# EAGLE design MaTouch ESP32-S3 2.13“ Quad-Color Eink V1.1 (EAGLE 6.1)
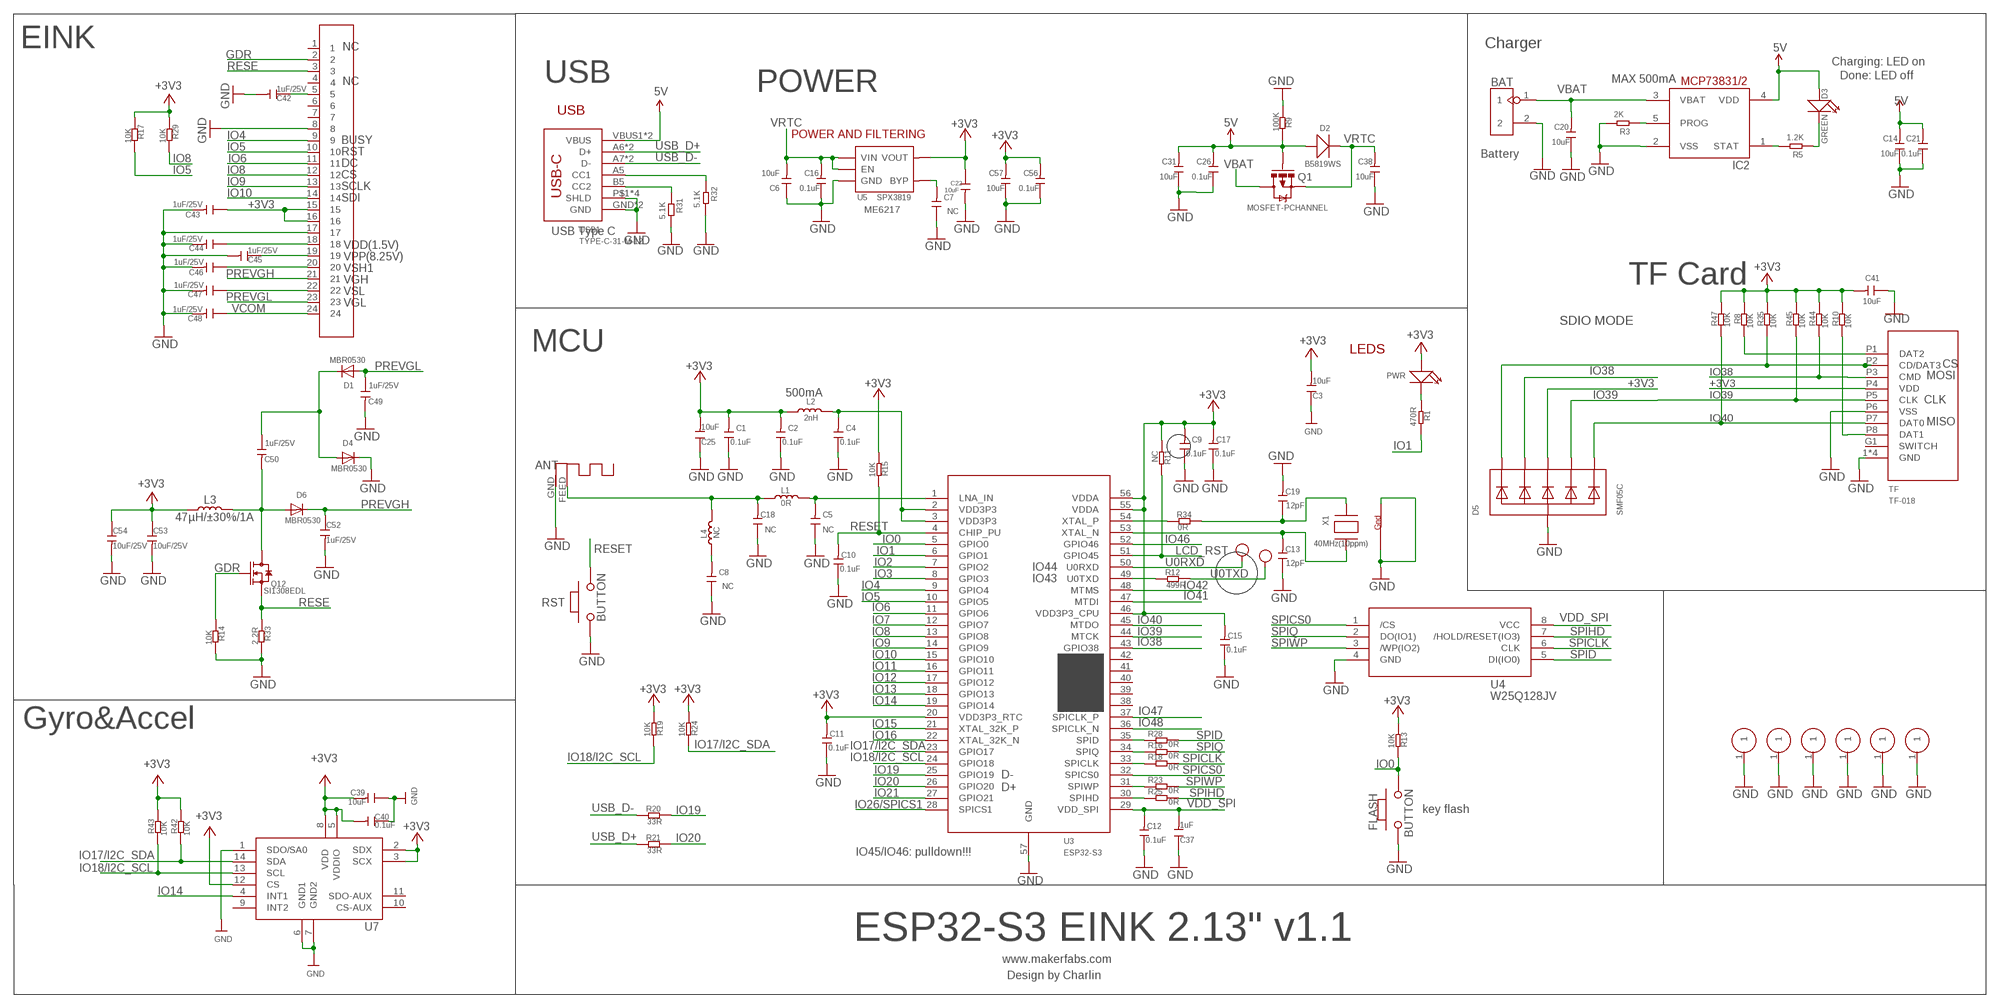
[diagram p0: schematic, sheet 1]

## Parts
ANT1  ANTENNA  [RN-ANT]
BAT  HEADER-2P-2.0  [2P-2.0]
C1  0.1uF  DISCRETE_C-0402  [DISCRETE_C0402]
C2  0.1uF  DISCRETE_C-0402  [DISCRETE_C0402]
C3  10uF  DISCRETE_C-0603  [DISCRETE_C0603]
C4  0.1uF  DISCRETE_C-0402  [DISCRETE_C0402]
C5  NC  DISCRETE_C-0402  [DISCRETE_C0402]
C6  10uF  DISCRETE_C-0603  [DISCRETE_C0603]
C7  NC  DISCRETE_C-0402  [DISCRETE_C0402]
C8  NC  DISCRETE_C-0402  [DISCRETE_C0402]
C9  0.1uF  DISCRETE_C-0402  [DISCRETE_C0402]
C10  0.1uF  DISCRETE_C-0402  [DISCRETE_C0402]
C11  0.1uF  DISCRETE_C-0402  [DISCRETE_C0402]
C12  0.1uF  DISCRETE_C-0402  [DISCRETE_C0402]
C13  12pF  DISCRETE_C-0402  [DISCRETE_C0402]
C14  10uF  DISCRETE_C-0402  [DISCRETE_C0402]
C15  0.1uF  DISCRETE_C-0402  [DISCRETE_C0402]
C16  0.1uF  DISCRETE_C-0402  [DISCRETE_C0402]
C17  0.1uF  DISCRETE_C-0402  [DISCRETE_C0402]
C18  NC  DISCRETE_C-0402  [DISCRETE_C0402]
C19  12pF  DISCRETE_C-0402  [DISCRETE_C0402]
C20  10uF  DISCRETE_C-0402  [DISCRETE_C0402]
C21  0.1uF  DISCRETE_C-0402  [DISCRETE_C0402]
C22  10uF  C-0603  [0603]
C25  10uF  DISCRETE_C-0603  [DISCRETE_C0603]
C26  0.1uF  DISCRETE_C-0402  [DISCRETE_C0402]
C31  10uF  DISCRETE_C-0402  [DISCRETE_C0402]
C37  1uF  DISCRETE_C-0603  [DISCRETE_C0603]
C38  10uF  DISCRETE_C-0402  [DISCRETE_C0402]
C39  10uF  DISCRETE_C-0402  [DISCRETE_C0402]
C40  0.1uF  DISCRETE_C-0402  [DISCRETE_C0402]
C41  10uF  DISCRETE_C-0402  [DISCRETE_C0402]
C42  1uF/25V  DISCRETE_C-0402  [DISCRETE_C0402]
C43  1uF/25V  DISCRETE_C-0402  [DISCRETE_C0402]
C44  1uF/25V  DISCRETE_C-0402  [DISCRETE_C0402]
C45  1uF/25V  DISCRETE_C-0402  [DISCRETE_C0402]
C46  1uF/25V  DISCRETE_C-0402  [DISCRETE_C0402]
C47  1uF/25V  DISCRETE_C-0402  [DISCRETE_C0402]
C48  1uF/25V  DISCRETE_C-0402  [DISCRETE_C0402]
C49  1uF/25V  DISCRETE_C-0402  [DISCRETE_C0402]
C50  1uF/25V  DISCRETE_C-0402  [DISCRETE_C0402]
C52  1uF/25V  C-0603  [0603]
C53  10uF/25V  C-0603  [0603]
C54  10uF/25V  C-0603  [0603]
C56  0.1uF  DISCRETE_C-0402  [DISCRETE_C0402]
C57  10uF  DISCRETE_C-0402  [DISCRETE_C0402]
D1  MBR0530  DIODESOD-323F  [SOD-323F]
D2  B5819WS  D'0805'  [SOD323]
D3  GREEN  DISCRETE_LED0603  [DISCRETE_LED-0603]
D4  MBR0530  DIODESOD-323F  [SOD-323F]
D5  SMF05C  TVSARRAY_5LANE  [SOT363]
D6  MBR0530  DIODESOD-323F  [SOD-323F]
FLASH  BUTTON  PB157  [157SW]
IC2  TP4054  MCP73831/OT  [SOT23-5L]
J1  FPC24-80P-A  [SMD24-80P-1960L440W]
L1  0R  DISCRETE_L0402  [DISCRETE_L0402]
L2  2nH  DISCRETE_L0603  [DISCRETE_L0603]
L3  47µH/±30%/1A  INDUCTOR-CR54-47UH  [CR54]
L4  NC  DISCRETE_L0402  [DISCRETE_L0402]
PWR  DISCRETE_LED0603  [DISCRETE_LED-0603]
Q1  MOSFET-PCHANNEL  [SOT23-3]
Q12  SI1308EDL  MOSFET-N'SOT23'  [SOT23]
R1  470R  DISCRETE_R-0402  [DISCRETE_R0402]
R3  2K  DISCRETE_R-0402  [DISCRETE_R0402]
R5  1.2K  DISCRETE_R-0402  [DISCRETE_R0402]
R8  10K  DISCRETE_R-0402  [DISCRETE_R0402]
R9  100K  DISCRETE_R-0402  [DISCRETE_R0402]
R10  10K  DISCRETE_R-0402  [DISCRETE_R0402]
R11  NC  DISCRETE_R-0402  [DISCRETE_R0402]
R12  499R  DISCRETE_R-0402  [DISCRETE_R0402]
R13  10K  DISCRETE_R-0402  [DISCRETE_R0402]
R14  10K  DISCRETE_R-0402  [DISCRETE_R0402]
R15  10K  DISCRETE_R-0402  [DISCRETE_R0402]
R16  0R  DISCRETE_R-0402  [DISCRETE_R0402]
R17  10K  DISCRETE_R-0402  [DISCRETE_R0402]
R18  0R  DISCRETE_R-0402  [DISCRETE_R0402]
R19  10K  DISCRETE_R-0402  [DISCRETE_R0402]
R20  33R  DISCRETE_R-0402  [DISCRETE_R0402]
R21  33R  DISCRETE_R-0402  [DISCRETE_R0402]
R23  0R  DISCRETE_R-0402  [DISCRETE_R0402]
R24  10K  DISCRETE_R-0402  [DISCRETE_R0402]
R25  0R  DISCRETE_R-0402  [DISCRETE_R0402]
R28  0R  DISCRETE_R-0402  [DISCRETE_R0402]
R29  10K  DISCRETE_R-0402  [DISCRETE_R0402]
R31  5.1K  DISCRETE_R-0402  [DISCRETE_R0402]
R32  5.1K  DISCRETE_R-0402  [DISCRETE_R0402]
R33  2.2R  DISCRETE_R-0402  [DISCRETE_R0402]
R34  0R  DISCRETE_R-0402  [DISCRETE_R0402]
R35  10K  DISCRETE_R-0402  [DISCRETE_R0402]
R42  10K  DISCRETE_R-0402  [DISCRETE_R0402]
R43  10K  DISCRETE_R-0402  [DISCRETE_R0402]
R44  10K  DISCRETE_R-0402  [DISCRETE_R0402]
R45  10K  DISCRETE_R-0402  [DISCRETE_R0402]
R47  10K  DISCRETE_R-0402  [DISCRETE_R0402]
RST  BUTTON  PB157  [157SW]
RX  TEST-POINT'4545'  [TP-D45MIL]
S1  ONEPIN01  [ONEPIN01]
S2  ONEPIN01  [ONEPIN01]
S3  ONEPIN01  [ONEPIN01]
S4  ONEPIN01  [ONEPIN01]
S5  ONEPIN01  [ONEPIN01]
S6  ONEPIN01  [ONEPIN01]
TF  TF-018  [TF-018]
TX  TEST-POINT'4545'  [TP-D45MIL]
U3  ESP32-S3  [QFN56-7*7MM]
U4  W25Q128JV  [SOIC-8-208MIL]
U5  SPX3819  [SOT23-5]
U7  QMI8658A  [LGA14-50P-300L250W86H]
USB1  TYPE-C-31-M-12  [TYPE-C-31-M-12]
X1  40MHz(10ppm)  XTAL-4-3225  [NX3225]

## Nets
5V: C14.2 C21.2 C26.2 C31.2 D2.+ D3.+ IC2.4(VDD) Q1.1(G) R9.2 USB1.VBUS1(VBUS) USB1.VBUS2(VBUS)
+3V3: C1.2 C2.2 C3.2 C9.2 C11.2 C15.2 C17.2 C22.1 C25.2 C39.2 C40.2 C41.2 C43.1 C53.1 C54.1 C56.2 C57.2 D5.4(C3) J1.15 J1.16 L2.1 L3.P$1 PWR.+ R8.2 R10.2 R11.2 R13.2 R15.2 R17.1 R19.2 R24.2 R29.1 R35.2 R42.2 R43.2 R44.2 R45.2 R47.2 TF.P4(VDD) U3.20(VDD3P3_RTC) U3.46(VDD3P3_CPU) U3.55(VDDA) U3.56(VDDA) U5.5(VOUT) U7.2(SDX) U7.3(SCX) U7.5(VDDIO) U7.8(VDD) U7.12(CS)
GDR: J1.2 Q12.1(G) R14.1
GND: ANT1.GND BAT.2 C1.1 C2.1 C3.1 C4.1 C5.1 C6.1 C7.1 C8.1 C9.1 C10.1 C11.1 C12.1 C13.1 C14.1 C15.1 C16.1 C17.1 C18.1 C19.2 C20.1 C21.1 C22.2 C25.1 C26.1 C31.1 C37.1 C38.1 C39.1 C40.1 C41.1 C42.2 C43.2 C44.2 C45.2 C46.2 C47.2 C48.2 C49.2 C52.2 C53.2 C54.2 C56.1 C57.1 D4.C D5.2(A) FLASH.1 IC2.2(VSS) J1.8 J1.17 R3.2 R9.1 R14.2 R31.2 R32.2 R33.2 RST.1 S1.1 S2.1 S3.1 S4.1 S5.1 S6.1 TF.1(GND) TF.2(GND) TF.3(GND) TF.4(GND) TF.P6(VSS) U3.57(GND) U4.4(GND) U5.2(GND) U7.1(SDO/SA0) U7.6(GND1) U7.7(GND2) USB1.GND USB1.GND2(GND) USB1.P$1(SHLD) USB1.P$2(SHLD) USB1.P$3(SHLD) USB1.P$4(SHLD) X1.2(G2) X1.4(G1)
IO0: FLASH.2 R13.1 U3.5(GPIO0)
IO1: R1.1 U3.6(GPIO1)
IO2: U3.7(GPIO2)
IO3: U3.8(GPIO3)
IO4: J1.9 U3.9(GPIO4)
IO5: J1.10 R17.2 U3.10(GPIO5)
IO6: J1.11 U3.11(GPIO6)
IO7: U3.12(GPIO7)
IO8: J1.12 R29.2 U3.13(GPIO8)
IO9: J1.13 U3.14(GPIO9)
IO10: J1.14 U3.15(GPIO10)
IO11: U3.16(GPIO11)
IO12: U3.17(GPIO12)
IO13: U3.18(GPIO13)
IO14: U3.19(GPIO14) U7.4(INT1)
IO15: U3.21(XTAL_32K_P)
IO16: U3.22(XTAL_32K_N)
IO17/I2C_SDA: R24.1 R42.1 U3.23(GPIO17) U7.14(SDA)
IO18/I2C_SCL: R19.1 R43.1 U3.24(GPIO18) U7.13(SCL)
IO19: R20.1 U3.25(GPIO19)
IO20: R21.1 U3.26(GPIO20)
IO21: U3.27(GPIO21)
IO26/SPICS1: U3.28(SPICS1)
IO38: D5.3(C2) R44.1 TF.P3(CMD) U3.43(GPIO38)
IO39: D5.5(C4) R45.1 TF.P5(CLK) U3.44(MTCK)
IO40: D5.6(C5) R47.1 TF.P7(DAT0) U3.45(MTDO)
IO41: U3.47(MTDI)
IO42: U3.48(MTMS)
IO46: U3.52(GPIO46)
IO47: U3.37(SPICLK_P)
IO48: U3.36(SPICLK_N)
LCD_RST: R11.1 U3.51(GPIO45)
N$1: ANT1.FEED C18.2 L1.1 L4.2
N$2: C5.2 L1.2 U3.1(LNA_IN)
N$3: R28.2 U3.35(SPID)
N$4: C8.2 L4.1
N$5: R32.1 USB1.A5(CC1)
N$6: C42.1 J1.5
N$7: PWR.- R1.2
N$8: C45.1 J1.19
N$9: C46.1 J1.20
N$10: C47.1 J1.22
N$11: C50.1 D1.C D4.A
N$21: R8.1 TF.P1(DAT2)
N$22: C44.1 J1.18
N$23: IC2.5(PROG) R3.1
N$28: R10.1 TF.P8(DAT1)
N$29: D5.1(C1) R35.1 TF.P2(CD/DAT3)
N$30: IC2.1(STAT) R5.2
N$32: D3.- R5.1
N$33: C4.2 L2.2 U3.2(VDD3P3) U3.3(VDD3P3)
N$34: R31.1 USB1.B5(CC2)
N$35: R16.2 U3.34(SPIQ)
N$37: R34.2 U3.54(XTAL_P)
N$38: R18.2 U3.33(SPICLK)
N$40: R23.2 U3.31(SPIWP)
N$41: R25.2 U3.30(SPIHD)
N$63: R12.2 U3.49(U0TXD)
N$65: C13.2 U3.53(XTAL_N) X1.3(X2)
N$66: C19.1 R34.1 X1.1(X1)
N$71: C50.2 D6.A L3.P$2 Q12.3(D)
N$76: C7.2 U5.4(BYP)
PREVGH: C52.1 D6.C J1.21
PREVGL: C49.1 D1.A J1.23
RESE: J1.3 Q12.2(S) R33.1
RESET: C10.2 R15.1 RST.2 U3.4(CHIP_PU)
SPICLK: R18.1 U4.6(CLK)
SPICS0: U3.32(SPICS0) U4.1(/CS)
SPID: R28.1 U4.5(DI(IO0))
SPIHD: R25.1 U4.7(/HOLD/RESET(IO3))
SPIQ: R16.1 U4.2(DO(IO1))
SPIWP: R23.1 U4.3(/WP(IO2))
U0RXD: RX.T U3.50(U0RXD)
U0TXD: R12.1 TX.T
USB_D+: R21.2 USB1.A6(D+) USB1.B6(D+)
USB_D-: R20.2 USB1.A7(D-) USB1.B7(D-)
VBAT: BAT.1 C20.2 IC2.3(VBAT) Q1.3(D)
VCOM: C48.1 J1.24
VDD_SPI: C12.2 C37.2 U3.29(VDD_SPI) U4.8(VCC)
VRTC: C6.2 C16.2 C38.2 D2.- Q1.2(S) U5.1(VIN) U5.3(EN)
Unconnected: J1.1 J1.4 J1.6 J1.7 TF.G1(SWITCH) U3.38(GPIO33) U3.39(GPIO34) U3.40(GPIO35) U3.41(GPIO36) U3.42(GPIO37) U7.9(INT2) U7.10(CS-AUX) U7.11(SDO-AUX)

## Notes on the sheet
- Charger
- EINK | NC
- Charging: LED on
- Done: LED off
- NC | USB | MAX 500mA
- POWER
- USB
- POWER AND FILTERING
- BUSY
- RST | Battery
- DC
- CS
- SCLK
- SDI
- ME6217
- USB Type C
- VDD(1.5V)
- VPP(8.25V)
- VSH1
- VGH | TF Card
- VSL
- VGL
- SDIO MODE
- MCU | LEDS
- CS
- MOSI
- 500mA
- CLK
- MISO
- ANT
- IO44
- IO43
- Gyro&Accel
- D-
- D+
- key flash
- IO45/IO46: pulldown!!!
- ESP32-S3 EINK 2.13" v1.1
- www.makerfabs.com
- Design by Charlin

## Library data of the parts
ANT1 = adafruit:ANTENNA
BAT = Connector:HEADER-2P
C1-C21 C25 C26 C31 C37-C50 C56 C57 = A9G:DISCRETE_C*: Ceramic Capacitors
C22 C52-C54 = Discrete:C*: Ceramic Capacitors
D1 D4 D6 = adafruit2:DIODE: Diode SMADIODE - SMA Surface Mount Package 20V 1A Schottky Diode Digikey: 641-1014-6-ND DO-1N4148 - Through Hole Small Current Diode SOD-123 20V 1 A (.5mV Vf) Schottky Diode - Digikey: MBRX120TPMSCT-ND SOD-323 10V 570mA (.38mV Vf, 3ns) Schottky Diode - Digikey: ZLLS410CT-ND SOD-523 30V 30mA Schottky Diode (RB751S-40TE61) - Digikey: RB751S-40TE61CT-ND SOT23-R/W - SOT23 Package (R = Solder Paste/Reflow Ovens, W = Hand-Soldering) BAT54Film 40V 300mA - Digikey: 497-7162-1-ND
D2 = Discrete:D*
D3 PWR = A9G:DISCRETE_LED*
D5 = microbuilder:TVSARRAY_5LANE: Voltage Transient Suppressor Array SOT363 SMF05C - 100W 5V: Digikey - SMF05CT1GOSCT-ND
FLASH RST = MySMD:PB157
IC2 = adafruit:MCP73831: MCP73831/2 Miniature Single-Cell, Fully Integrated Li-Ion, Li-Polymer Charge Management Controllers. Nice and small simple lipoly charge controller, with adjustable current and status output (LED) http://www.ladyada.net/library/pcb/eaglelibrary.html
J1 = user:FPC24-80P-A
L1 L2 L4 = A9G:DISCRETE_L*
L3 = SparkFun-Coils:INDUCTOR: Inductors Resist changes in electrical current. Basically a coil of wire. SparkFun Products: SparkFun Load Cell Amplifier - HX711 <https://www.sparkfun.com/products/13879> IOIO-OTG - V2.2 <https://www.sparkfun.com/products/13613>; PROD_ID: NDUC-10789; VALUE: 47µH/±30%/750mA
Q1 = User-Submitted:MOSFET-PCHANNEL: Generic PMOSFET IRLML2244 - TRANS-11153 (SOT-23 -20V -4.3A) (1.Gate 2.Source 3.Drain) FQP27P06 - COM-10349 <http://www.sparkfun.com/products/10349> (TO-220 -60V -27A) (1.Gate 2.Source 3.Drain); PROD_ID: TRANS-08285
Q12 = Discrete:MOSFET-N: IRLL014: http://www.vishay.com/docs/91319/sihll014.pdf
R1 R3 R5 R8-R21 R23-R25 R28 R29 R31-R35 R42-R45 R47 = A9G:DISCRETE_R*
RX TX = Discrete-new:TEST-POINT; PARTNO: DNP
S1-S6 = user:ONEPIN01
TF = sale:TF-018
U3 = sale:ESP32-S3
U4 = self:W25Q128JV
U5 = IC:SPX3819
U7 = user:QMI8658A
USB1 = sale:TYPE-C-31-M-12
X1 = adafruit:XTAL-4: Classic 4-pin 3.2 x 2.5mm crystal

## Net classes
0 default: width 0.203 mm, drill 0.305 mm, clearance 0.152 mm
1 vbat: width 0.254 mm, drill 0.305 mm, clearance 0.203 mm

## Board
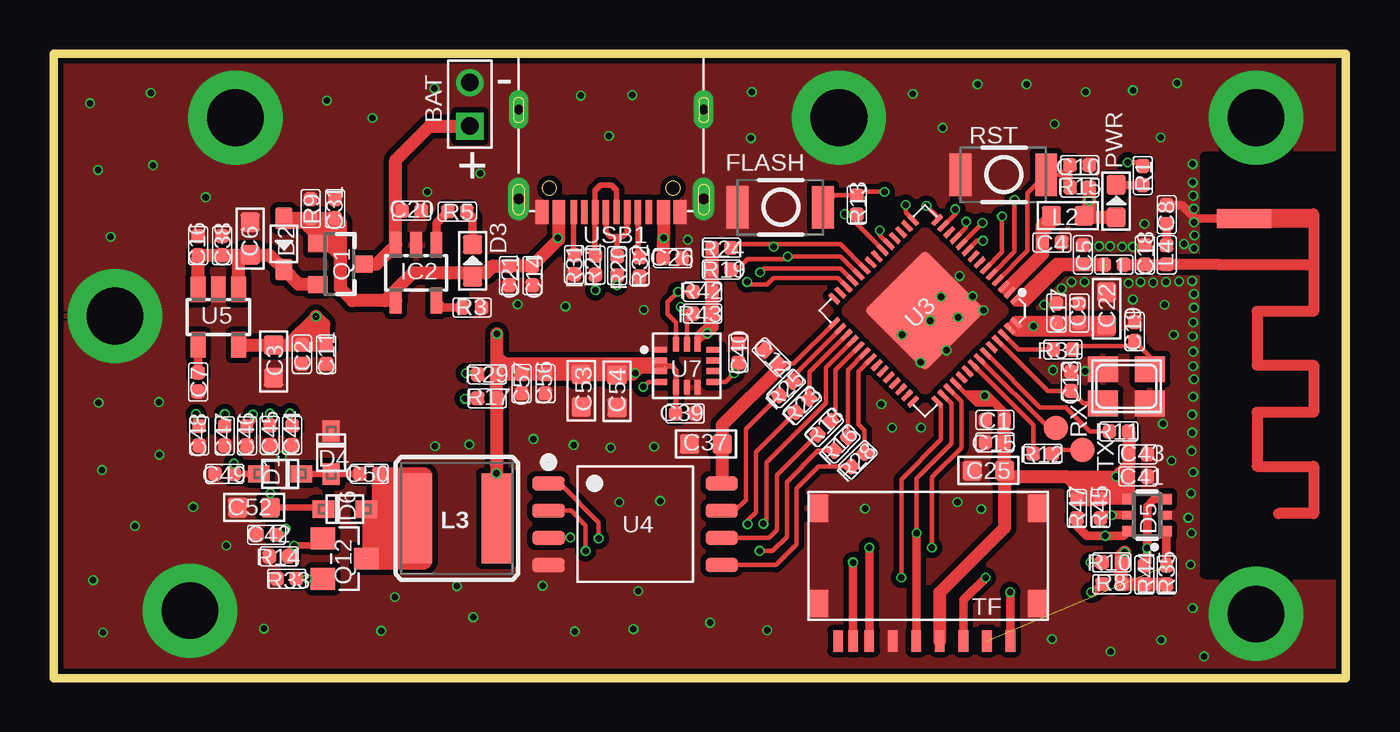
[diagram p1: board, top side]
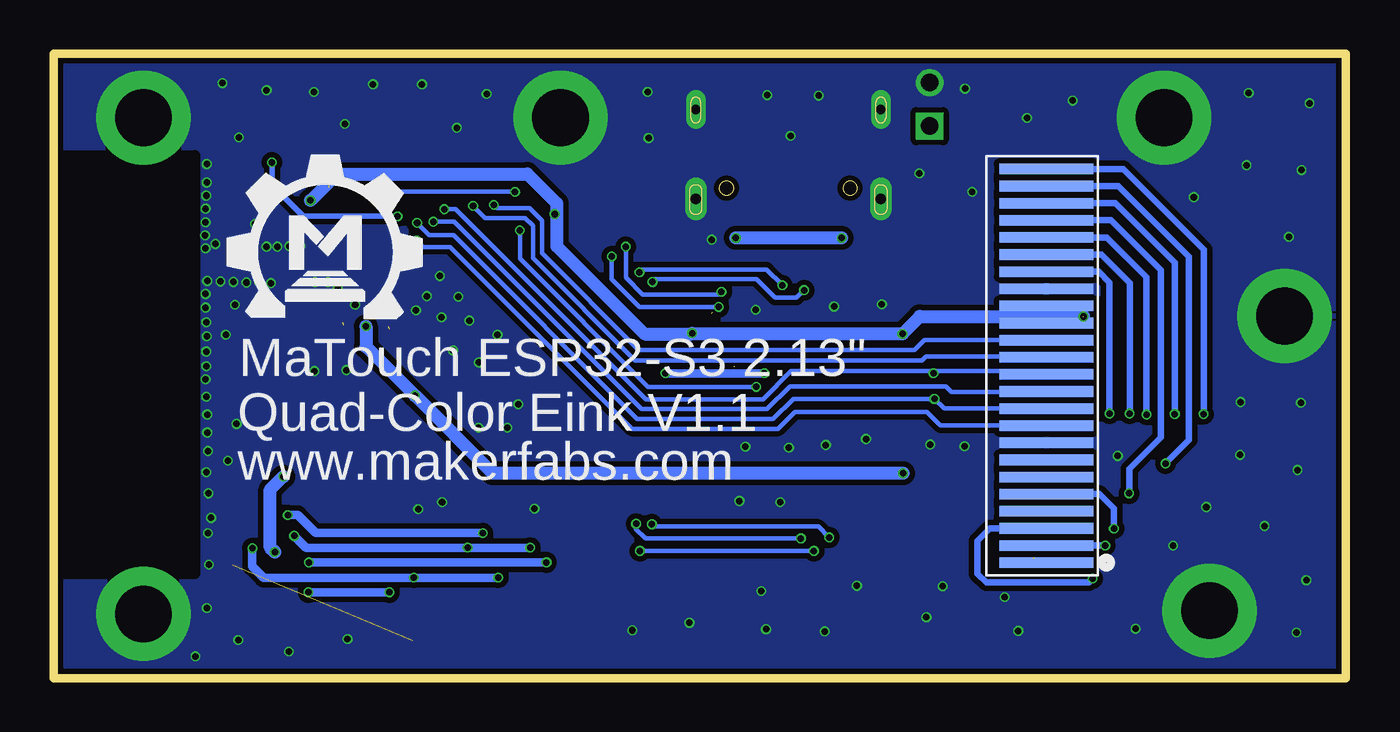
[diagram p2: board, bottom side, seen from below]

Size 60.4 x 29.2 mm. Coordinates in mm from the lower left corner, seen from the top.
Outline: 0,29.2 0,0 60.4,0 60.4,29.2 0,29.2
Copper layers (1*16): Top 0.035mm / dielectric 1.5mm / Bottom 0.035mm
Design rules: minimum track width 6mil, minimum drill 10mil, track to track 6mil, track to pad 6mil, pad to pad 6mil, via to via 6mil, smd to smd 0mil, copper to edge 10mil, drill to drill 10mil, minimum pad ring 3mil, minimum via ring 3mil, stop-mask expansion 2mil, vias tented up to drill 100mil, thermal gap 0mil
tRestrict: area 53.8,4.9 to 61.4,24.4
bRestrict: area 53.8,4.9 to 61.3,24.4

### Footprints (pad centres in the part's own frame; a part is rotated, then mirrored left to right if it is on the bottom)
RN-ANT = smd 0.025 x 0.025: FEED 0,2.159 | smd 2.54 x 0.889: GND -1.143,0
2P-2.0 = drill 0.813 pad 1.27 square: 1 -1.016,0 | drill 0.813 pad 1.27: 2 1.016,0
DISCRETE_C0402 = smd 0.635 x 0.635: 1 -0.445,0; 2 0.445,0
DISCRETE_C0603 = smd 0.889 x 0.889: 1 -0.762,0; 2 0.762,0
0603 = smd 0.889 x 0.889: 1 -0.762,0; 2 0.762,0
SOD-323F = smd 1 x 0.8: A -1,0; C 1,0
SOD323 = smd 1 x 0.8: + -1.2,0; - 1.2,0
DISCRETE_LED-0603 = smd 0.889 x 0.889: + -0.762,0; - 0.762,0
SOT363 = smd 0.5 x 0.5: 1 -0.75,-0.9; 3 0.75,-0.9; 4 0.75,0.9; 6 -0.75,0.9 | smd 0.4 x 0.5: 2 0,-0.9; 5 0,0.9
157SW = smd 1.016 x 1.981: 1 0,0; 2 4,0
SOT23-5L = smd 0.55 x 1.2: 1 -0.95,-1.3; 2 0,-1.3; 3 0.95,-1.3; 4 0.95,1.3; 5 -0.95,1.3
SMD24-80P-1960L440W = smd 0.5 x 4.4: 1 -9.2,0; 2 -8.4,0; 3 -7.6,0; 4 -6.8,0; 5 -6,0; 6 -5.2,0; 7 -4.4,0; 8 -3.6,0; 9 -2.8,0; 10 -2,0; 11 -1.2,0; 12 -0.4,0; 13 0.4,0; 14 1.2,0; 15 2,0; 16 2.8,0; 17 3.6,0; 18 4.4,0; 19 5.2,0; 20 6,0; 21 6.8,0; 22 7.6,0; 23 8.4,0; 24 9.2,0
DISCRETE_L0402 = smd 0.635 x 0.635: 1 -0.445,0; 2 0.445,0
DISCRETE_L0603 = smd 0.889 x 0.889: 1 -0.762,0; 2 0.762,0
CR54 = smd 4.2 x 1.4: P$1 0,1.85; P$2 0,-1.85
SOT23-3 = smd 0.8 x 0.9: 1 -0.95,-1; 2 0.95,-1; 3 0,1.1
SOT23 = smd 1.016 x 1.143: 1 -0.95,-1.016; 2 0.95,-1.016; 3 0,1.016
DISCRETE_R0402 = smd 0.635 x 0.635: 1 -0.445,0; 2 0.445,0
TP-D45MIL = smd 1.143 x 1.143: T 0,0
ONEPIN01 = drill 2.65 pad 4.4: 1 0,0
TF-018 = smd 1 x 1.3: 1 -5.15,2.225; 2 -5.15,-2.225; 3 5.15,-2.225; 4 5.15,2.225 | smd 0.5 x 1: G1 -4.2,-3.975; P1 3.85,-3.975; P2 2.75,-3.975; P3 1.65,-3.975; P4 0.55,-3.975; P5 -0.55,-3.975; P6 -1.65,-3.975; P7 -2.75,-3.975; P8 -3.5,-3.975
QFN56-7*7MM = smd 0.6 x 0.2: 1 -3.4,2.6; 2 -3.4,2.2; 3 -3.4,1.8; 4 -3.4,1.4; 5 -3.4,1; 6 -3.4,0.6; 7 -3.4,0.2; 8 -3.4,-0.2; 9 -3.4,-0.6; 10 -3.4,-1; 11 -3.4,-1.4; 12 -3.4,-1.8; 13 -3.4,-2.2; 14 -3.4,-2.6; 29 3.4,-2.6; 30 3.4,-2.2; 31 3.4,-1.8; 32 3.4,-1.4; 33 3.4,-1; 34 3.4,-0.6; 35 3.4,-0.2; 36 3.4,0.2; 37 3.4,0.6; 38 3.4,1; 39 3.4,1.4; 40 3.4,1.8; 41 3.4,2.2; 42 3.4,2.6 | smd 0.2 x 0.6: 15 -2.6,-3.4; 16 -2.2,-3.4; 17 -1.8,-3.4; 18 -1.4,-3.4; 19 -1,-3.4; 20 -0.6,-3.4; 21 -0.2,-3.4; 22 0.2,-3.4; 23 0.6,-3.4; 24 1,-3.4; 25 1.4,-3.4; 26 1.8,-3.4; 27 2.2,-3.4; 28 2.6,-3.4; 43 2.6,3.4; 44 2.2,3.4; 45 1.8,3.4; 46 1.4,3.4; 47 1,3.4; 48 0.6,3.4; 49 0.2,3.4; 50 -0.2,3.4; 51 -0.6,3.4; 52 -1,3.4; 53 -1.4,3.4; 54 -1.8,3.4; 55 -2.2,3.4; 56 -2.6,3.4 | smd 4 x 4: 57 0,0
SOIC-8-208MIL = smd 1.5 x 0.635: 1 -4.05,1.905; 2 -4.05,0.635; 3 -4.05,-0.635; 4 -4.05,-1.905; 5 4.05,-1.905; 6 4.05,-0.635; 7 4.05,0.635; 8 4.05,1.905
SOT23-5 = smd 0.69 x 1.2: 1 -0.95,-1.3; 2 0,-1.3; 3 0.95,-1.3; 4 0.95,1.3; 5 -0.95,1.3
LGA14-50P-300L250W86H = smd 0.675 x 0.28: 1 -1.262,0.75; 2 -1.262,0.25; 3 -1.262,-0.25; 4 -1.262,-0.75; 8 1.262,-0.75; 9 1.262,-0.25; 10 1.262,0.25; 11 1.262,0.75 | smd 0.28 x 0.675: 5 -0.5,-1.012; 6 0,-1.012; 7 0.5,-1.012; 12 0.5,1.012; 13 0,1.012; 14 -0.5,1.012
TYPE-C-31-M-12 = smd 0.3 x 1.1: A5 -1.25,0.05; A6 -0.25,0.05; A7 0.25,0.05; A8 1.25,0.05; B5 1.75,0.05; B6 0.75,0.05; B7 -0.75,0.05; B8 -1.75,0.05 | smd 0.6 x 1.1: GND -3.225,0.05; GND2 3.225,0.05; VBUS1 -2.45,0.05; VBUS2 2.45,0.05 | drill 0.5 pad 1.016 long: P$1 4.32,-0.57; P$2 -4.32,-0.57 | drill 0.45 pad 0.9 long: P$3 -4.32,-4.75; P$4 4.32,-4.75
NX3225 = smd 1.4 x 1.2: 1 -1.1,-0.8; 2 1.1,-0.8; 3 1.1,0.8; 4 -1.1,0.8

### Placement (x,y rotation side)
ANT1  54.5,21.49 180 top
BAT  19.46,26.82 90 top
C1  43.99,12.06 0 top
C2  11.61,15.14 90 top
C3  10.29,14.81 90 top
C4  46.66,20.37 180 top
C5  48.11,19.79 270 top
C6  9.19,20.55 270 top
C7  6.76,13.84 90 top
C8  52.02,21.67 270 top
C9  47.93,17.07 270 top
C10  47.96,23.98 180 top
C11  12.75,15.14 90 top
C12  33.55,15.01 315 top
C13  47.55,13.87 270 top
C14  22.38,18.82 90 top
C15  43.99,11.02 0 top
C16  6.76,20.22 270 top
C17  46.86,17.07 270 top
C18  51,19.79 270 top
C19  50.52,16.21 90 top
C20  16.74,21.84 180 top
C21  21.29,18.82 90 top
C22  49.21,17.27 90 top
C25  43.69,9.7 0 top
C26  28.93,19.63 180 top
C31  13.16,21.95 270 top
C37  30.49,10.95 0 top
C38  7.87,20.22 270 top
C39  29.51,12.37 180 top
C40  32,15.19 270 top
C41  50.67,9.42 180 top
C42  9.96,6.71 180 top
C43  50.67,10.46 0 top
C44  11.15,11.35 270 top
C45  10.11,11.35 270 top
C46  9.04,11.33 270 top
C47  8,11.33 270 top
C48  6.81,11.33 270 top
C49  8,9.55 180 top
C50  14.76,9.55 0 top
C52  9.37,7.98 180 top
C53  24.66,13.44 270 top
C54  26.34,13.41 270 top
C56  22.99,13.77 90 top
C57  21.87,13.77 90 top
D1  10.59,9.55 0 top
D2  10.77,20.29 270 top
D3  19.58,19.51 90 top
D4  12.98,10.54 90 top
D5  51.1,7.62 90 top
D6  13.61,7.9 180 top
FLASH  31.96,22.01 0 top
IC2  16.94,18.95 180 top
J1  14,14.6 90 bottom
L1  49.56,19.33 180 top
L2  47.4,21.62 180 top
L3  18.85,7.47 270 top
L4  52.02,19.79 270 top
PWR  49.66,22.3 90 top
Q1  13.36,19.35 270 top
Q12  13.61,5.59 270 top
R1  50.9,23.5 270 top
R3  19.56,17.32 0 top
R5  18.87,21.82 180 top
R8  49.45,4.39 0 top
R9  12.01,21.95 270 top
R10  49.45,5.41 0 top
R11  49.78,11.53 0 top
R12  46.23,10.49 180 top
R13  37.54,22.12 270 top
R14  10.54,5.69 180 top
R15  47.96,22.94 0 top
R16  36.8,10.95 45 top
R17  20.27,13.08 180 top
R18  36.02,11.71 45 top
R19  31.22,19.1 180 top
R20  26.34,19.28 90 top
R21  25.32,19.3 90 top
R23  35,12.75 45 top
R24  31.22,20.12 180 top
R25  34.24,13.54 45 top
R28  37.59,10.21 45 top
R29  20.27,14.2 180 top
R31  24.33,19.33 270 top
R32  27.38,19.23 270 top
R33  10.9,4.65 180 top
R34  47.17,15.37 180 top
R35  52.02,4.83 270 top
R42  30.33,18.06 0 top
R43  30.33,17.04 0 top
R44  50.98,4.83 270 top
R45  48.92,7.92 90 top
R47  47.83,7.92 90 top
RST  42.38,23.53 0 top
RX  46.84,11.68 90 top
S1  6.38,3.15 0 top
S2  2.87,16.93 0 top
S3  56.2,26.2 0 top
S4  56.2,3 0 top
S5  8.5,26.2 0 top
S6  36.7,26.2 0 top
TF  40.87,5.71 0 top
TX  48.08,10.67 90 top
U3  40.73,17.17 225 top
U4  27.18,7.19 0 top
U5  7.71,16.88 180 top
U7  29.6,14.6 0 top
U$1  [MAKERFABS_0.3]  51.82,16.85 0 bottom
USB1  26.06,21.83 180 top
X1  50.14,13.64 180 top

### Tracks (layer width: path | path; a pad name or v marks a point on that pad's centre or on a via)
5V  (via drill 0.3)
  Top 0.254: USB1.VBUS2 23.61,20.61 v23.57,20.57
  Top 0.406: 13.41,19.61 12.85,20.12 12.85,21.23 13.13,20.95 13.13,20.07 11.99,21.21 11.68,21.21 | 10.77,21.21 11.68,21.21 | 11.68,21.21 12.17,20.73
  Top 0.61: D2.+ R9.2 12.55,21.5 | 12.55,21.5 C31.2 13.21,21.5 13.41,21.3 13.41,19.61 13.41,18.21 13.97,17.65 15.49,17.65 | Q1.1 12.36,21.31 12.55,21.5 | IC2.4 15.49,17.65 | 19.38,18.95 D3.+ 19.53,18.8 19.53,18.95 | 15.49,17.65 16.79,18.95 19.53,18.95 | USB1.VBUS2 23.61,20.51 C14.2 C21.2 20.54,19.27 20.22,18.95 19.53,18.95 | USB1.VBUS1 v28.51,20.57 28.51,19.66 C26.2
  Bottom 0.61: v23.57,20.57 v28.51,20.57
+3V3  (via drill 0.3)  (4 unrouted)
  Top 0.203: U3.55 U3.56 44.99,16.62 | 42.85,13.08 U3.46 42.72,13.21 v43.51,13.21 | 43.66,13.08 43.87,13.08 44.44,12.51 C1.2 44.44,12.15 | C15.2 44.42,10.68 | R11.2 C43.1 | 48.23,21.54 48.39,21.69 | R42.2 R19.2 R24.2 | 44.32,11.86 44.32,12.42 43.66,13.08 | 43.66,13.08 42.85,13.08 | 42.85,13.08 42.75,13.18 | 42.85,13.08 43.13,12.8 43.92,12.8 44.22,12.5 44.22,12.04 44.65,12.04 44.65,12.32 43.61,13.36 42.6,13.36 42.77,13.18 43.66,13.18 43.84,13.01 43.81,12.98 43.13,12.98 | U7.12 30.1,15.67 | R43.2 30.77,16.34 v30.56,16.13 | 30.1,15.6 30.07,15.62 30.07,16.08 30.56,16.56 30.56,20.3 30.58,20.32 30.96,20.32 30.99,20.3 30.99,16.36 30.58,15.95 30.38,15.95 30.1,15.67 | 30.1,15.67 30.1,15.88 30.66,16.43 30.66,19.81 30.86,19.81 30.86,16.38 | U3.20 37.54,21.21 R13.2 37.53,21.69 v36.98,21.69 | 45.01,16.15 45.5,16.15 v45.8,16.45 | U7.3 27.23,14.35 | 27.23,14.35 25.96,14.35 25.81,14.2 | v27.18,14.25 27.18,14.3 27.23,14.35 | U7.8 31.4,13.85 v31.8,14.25 32,14.45 C40.2 | 28.55,14.35 28.52,14.33 27.46,14.33 27.13,13.99 25.88,13.99 26.06,14.17 27.13,14.17 27.51,14.55 28.57,14.55 28.57,14.88 21.13,14.88 20.88,15.14 20.88,14.96 21.13,14.71 27.53,14.71 | 28.52,14.71 27.53,14.71 | 27.53,14.71 27.36,14.53 21.13,14.53 21.03,14.63
  Top 0.254: 26.52,14.35 C54.1 | U7.2 U7.3 28.57,14.58 28.91,14.58 29.1,14.38 U7.5 29.1,12.4 C39.2 | R43.2 R42.2 | 20.73,14.21 R29.1 | 30.1,15.6 30.1,15.73 30.45,16.09 | 30.38,15.95 v30.56,16.13
  Top 0.406: 48.23,21.54 L2.1 48.4,21.86 | D5.4 50.2,8.91 50.2,9.4 C41.2 C43.1 | 44.73,16.48 44.73,16.43 45.01,16.15 49.43,16.15 49.45,16.18 48.9,16.74 44.98,16.74 44.73,16.48 | 44.73,16.48 46.81,16.48 46.84,16.51
  Top 0.61: PWR.+ 48.23,21.54 | R15.2 48.4,21.86 | 48.39,21.69 v48.39,22.33 | v20.73,16.09 20.73,14.21 C57.2 C56.2 24.65,14.21 C53.1 25.81,14.2 26.31,14.2 C54.1 | TF.P4 41.42,4 44.45,7.04 44.45,9.17 | R35.2 R44.2 49.91,4.38 R8.2 R10.2 49.9,5.73 v50.06,5.89 | v49.66,9.42 C41.2 | 47.37,9.4 47.57,9.4 | 47.57,9.4 49.12,9.4 | 49.12,9.4 49.72,9.4 50.2,8.91 | 44.45,9.17 C25.2 44.44,9.41 C15.2 C1.2 | R47.2 47.83,9.14 47.57,9.4 | R45.2 48.92,9.2 49.12,9.4 | 47.83,8.36 48.92,8.36 49,8.43 50.14,8.43 50.24,8.53 50.24,9.98 | R11.2 50.24,9.98 | 50.24,9.98 49.63,9.37 49.63,8.97 49.71,8.89 | 49.81,8.79 49.71,8.89 | 49.71,8.89 47.88,8.89 47.37,9.4 | 47.37,9.4 44.68,9.4 44.45,9.17 | C17.2 C9.2 49.09,16.62 C22.1 | U5.5 C3.2 10.3,15.58 C2.2 C11.2 12.62,15.71 12.62,16.55 v12.27,16.9 | R29.1 R17.1 20.7,13.06 20.7,9.99 20.7,9.98 v20.7,9.58 v20.7,9.57 L3.P$1 | v12.27,16.89 10.97,15.6 11.66,15.6 12.34,16.28
  Bottom 0.203: 36.88,22.2 36.98,22.1 v36.98,21.69 | 27.23,14.25 v27.18,14.25
  Bottom 0.254: J1.16 J1.15 16.05,16.65 16.05,16.9
  Bottom 0.406: v31.8,14.25 27.23,14.25
  Bottom 0.61: v50.06,5.89 50.27,6.1 50.27,8.81 v49.66,9.42 | v48.39,22.33 47.14,23.57 38.25,23.57 36.88,22.2 36.88,20.19 32.78,16.09 30.59,16.09 v30.56,16.13 30.52,16.09 v20.73,16.09 19.91,16.9 16.05,16.9 v12.27,16.9 | v45.8,16.45 45.8,15.49 v43.51,13.21 39.88,9.58 v20.7,9.58
GDR  (via drill 0.3)
  Top 0.305: R14.1 10.99,5.93 v11.25,6.2 12.26,6.2 Q12.1
  Bottom 0.305: J1.2 v11.26,6.2 v11.25,6.2
GND  (via drill 0.3)
  Top 0.406: ANT1.GND 53.37,21.49 52.73,22.12 52.03,22.12 C8.1
  other vias: 50.44,17.7 53.77,1.02 42.27,16.87 27.1,2.29 43.36,7.9 51.77,1.78 53.24,3.28 39.65,16.05 40.51,14.76 41.48,17.83 43.46,17.2 41.73,15.32 40.97,16.71 42.34,18.8 42.95,17.86 47.12,18.21 47.57,18.52 48.18,18.52 46.3,17.45 48.87,20.19 49.38,20.19 49.94,20.17 50.44,20.17 52.83,20.29 53.29,20.09 53.31,20.7 53.29,21.31 53.29,21.95 53.26,22.56 53.24,23.16 53.24,24.03 50.98,21.23 50.24,18.47 50.8,18.52 51.38,18.49 51.99,18.52 52.6,18.54 53.21,18.57 53.29,17.96 53.29,17.32 53.26,16.64 53.24,15.98 53.26,15.27 53.26,14.58 53.29,13.97 53.26,13.16 53.21,12.32 53.21,11.48 53.19,10.62 53.26,9.63 53.16,8.64 53.04,7.49 53.19,6.78 53.14,5.31 46.71,14.4 48.21,14.35 51.92,17.45 52.35,16.05 51.84,11.89 52.25,10.16 49.4,1.24 46.66,1.83 42.24,8.23 39.19,11.71 37.92,7.92 33.35,2.24 30.68,2.59 24.36,2.18 19.61,2.84 15.32,2.21 9.83,2.31 2.31,2.13 3.81,7.11 2.11,12.88 1.7,26.87 2.67,20.62 2.08,23.75 12.78,27 17.81,27.56 24.64,27.23 27.05,27.25 32.64,27.41 25.96,25.35 40.16,27.3 43.18,27.76 45.47,27.76 48.23,27.41 50.44,27.48 52.5,27.81 51.74,25.27 46.79,25.91 41.55,25.73 32.59,25.25 21.69,17.48 27.58,17.22 23.93,17.37 2.26,9.73 1.85,4.57 15.95,3.78 22.43,11.18 24.31,10.9 28.07,10.82 26.04,10.77 28.35,8.28 26.44,8.23 22.86,4.32 27.33,4.06 18.85,4.29 8.08,6.2 6.53,8 4.95,10.44 4.93,12.9 4.65,23.98 14.91,26.19 40.54,11.71 38.68,12.8 19.94,23.6 19.43,10.92 4.55,27.36 7.11,22.48 10.67,10.39 17.83,10.85 29.64,20.5 17.48,22.73
  pour Top (isolate 0.254, rank 6): -10,38.1 -10,-5 85,-5 85,38.1
  pour Bottom (isolate 0.254, rank 6): -11,-5 85,-5 85,38.1 -11,38.1
IO0  (via drill 0.3)
  Top 0.203: FLASH.2 36.52,22.57 R13.1 37.43,22.73 v38.84,22.73 | U3.5 44.91,19.93 v44.91,22.35
  Bottom 0.203: v44.91,22.35 44.53,22.73 v38.84,22.73
IO1  (via drill 0.3)
  Top 0.203: U3.6 44.32,19.91 v44.32,21.59
  Top 0.254: v50.19,24.11 50.74,24.11 R1.1
  Bottom 0.254: v44.32,21.59 48.74,21.59 50.19,23.04 v50.19,24.11
IO4  (via drill 0.3)
  Top 0.203: U3.9 43.16,20.45 v43.43,20.45
  Bottom 0.203: v43.43,20.45 43.13,20.14 41.86,20.14 33.38,11.66 26.54,11.66 25.76,12.45 19.58,12.45 18.95,11.81 16.01,11.81
  Bottom 0.254: 16.01,11.81 J1.9
IO5  (via drill 0.3)
  Top 0.203: R17.2 19.25,13.08 v19.23,13.06 | U3.10 43.41,21.26 v43.41,21.29
  Bottom 0.203: v43.41,21.29 43.41,21.26 42.85,20.7 41.71,20.7 33.12,12.12 26.77,12.12 25.83,13.06 v19.23,13.06 18.77,12.6 J1.10
IO6  (via drill 0.3)
  Top 0.203: U3.11 42.65,21.07 v42.65,21.34
  Bottom 0.203: v42.65,21.34 41.68,21.34 32.92,12.57 27.05,12.57 25.98,13.64 18.69,13.64 18.44,13.39 16.01,13.39
  Bottom 0.254: 16.01,13.39 J1.11
IO8  (via drill 0.3)
  Top 0.203: R29.2 19.77,14.25 v19.28,14.25 | U3.13 42.14,21.69 v42.14,21.92
  Bottom 0.203: 19.18,14.35 16,14.35 14.15,14.35 J1.12 | 19.18,14.35 25.93,14.35 27.25,13.03 32.72,13.03 41.6,21.92 v42.14,21.92 | v19.28,14.25 19.18,14.35
IO9  (via drill 0.3)
  Top 0.203: U3.14 41.3,21.57 v40.79,22.07
  Bottom 0.203: v40.79,22.07 40.23,21.51 38.35,21.51 38,21.16 38,19.63 33.21,14.85 19.82,14.85 19.63,15.04 16.04,15.04
  Bottom 0.254: 16.04,15.04 J1.13
IO10  (via drill 0.3)
  Top 0.203: U3.15 39.83,21.76 v39.83,22.12
  Bottom 0.203: v39.83,22.12 39.67,21.97 38.15,21.97 37.57,21.39 37.57,19.86 33.05,15.35 20.16,15.35 19.71,15.8 16,15.8
  Bottom 0.254: 16,15.8 J1.14
IO14  (via drill 0.3)
  Top 0.203: U3.19 38.61,20.71 v38.61,20.93 | U7.4 27.8,13.85 v27.56,13.61
  Bottom 0.203: v38.61,20.93 38.61,19.61 32.61,13.61 v27.56,13.61
IO17/I2C_SDA  (via drill 0.3)
  Top 0.203: U3.23 36.76,20.3 33.78,20.3 | R42.1 v29.18,18.06 28.7,17.58 28.7,17.02 29.1,16.62 U7.14 | 33.78,20.3 v33.66,20.17 | R24.1 31.84,20.3 33.78,20.3
  Bottom 0.203: v29.18,18.06 29.31,17.93 32.87,17.93 33.66,18.72 v33.66,20.17
IO18/I2C_SCL  (via drill 0.3)  (1 unrouted)
  Top 0.203: U3.24 36.78,19.71 v34.31,19.71 34.19,19.58 32.44,19.58 31.95,19.1 R19.1 | U7.13 29.6,17.11 | R43.1 29.62,17.04 v29.31,17.35
  Bottom 0.203: v29.31,17.35 33.02,17.35 34.31,18.64 v34.31,19.71
IO19  (via drill 0.3)
  Top 0.203: v26.34,18.36 R20.1 | U3.25 36.77,19.15 33.2,19.15 v33.02,18.97
  Bottom 0.203: v26.34,18.36 27.08,19.1 32.89,19.1 v33.02,18.97
IO20  (via drill 0.3)
  Top 0.203: v25.32,18.14 R21.1 | U3.26 36.67,18.69 33.66,18.69 33.35,18.39 32.54,18.39 v32.41,18.52
  Bottom 0.203: v25.32,18.14 25.68,17.78 26.7,17.78 27.56,18.64 32.28,18.64 v32.41,18.52
IO38  (via drill 0.3)
  Top 0.203: v39.62,4.7 39.62,9.3 41.48,11.15 41.48,12.75 U3.43
  Top 0.406: D5.3 51.45,8.37 51.1,8.03 v51.1,6.07 51.1,5.4 R44.1 | TF.P3 42.52,3.66 v43.56,4.7
  Bottom 0.406: v39.62,4.7 v43.56,4.7 50.57,4.7 51.1,5.23 v51.1,6.07
IO39  (via drill 0.3)
  Top 0.203: U3.44 41.96,12.84 41.96,10.97 40.34,9.35 v40.34,6.78
  Top 0.406: R45.1 49.06,7.62 v49.45,7.62 D5.5 | TF.P5 40.32,6.76 v40.34,6.78
  Bottom 0.406: 49.43,7.62 v49.45,7.62 49,7.62 48.16,6.78 v40.34,6.78
IO40  (via drill 0.3)
  Top 0.203: U3.45 42.42,12.94 42.42,10.77 41.05,9.4 v41.05,6.1 | 38.12,6.09 v38.12,6.1
  Top 0.406: TF.P7 38.12,6.09 | D5.6 49.99,6.66 v49.15,6.66 48.28,6.66 47.83,7.11 R47.1
  Bottom 0.406: v38.12,6.1 v41.05,6.1 48.59,6.1 v49.15,6.66
LCD_RST
  Top 0.203: U3.51 46.11,12.65 47.32,12.65 48.44,11.53 R11.1
N$1
  Top 0.406: 52.03,19.33 L4.2
  Top 0.508: L1.1 C18.2 | C18.2 L4.2 | ANT1.FEED 52.03,19.33
  Top 0.61: C18.2
N$2  (1 unrouted)
  Top 0.203: U3.1 46.58,19.34 C5.2 | 49.25,19.28 49.1,19.13 47.14,19.13 45.49,17.48 44.96,17.48 44.86,17.58 46.81,19.53 47.04,19.53 | 49.02,19.53 47.04,19.53 | 47.04,19.53 45.09,17.58 45.31,17.58 46.97,19.23 48.01,19.23
  Top 0.508: C5.2 49.1,19.34
  Top 0.61: 49.1,19.34 L1.2
N$3
  Top 0.203: U3.35 37.62,14.34 37.62,11.86 37.9,11.58 37.9,10.54 R28.2
N$4
  Top 0.406: L4.1 C8.2
N$5
  Top 0.254: USB1.A5 27.31,19.74 R32.1
N$6  (via drill 0.3)
  Top 0.305: C42.1 10.57,6.71 v10.85,6.99
  Bottom 0.305: J1.5 11.52,8.6 10.85,7.92 v10.85,6.99
N$7
  Top 0.406: R1.2 PWR.-
N$8  (via drill 0.3)
  Top 0.305: C45.1 v10.11,12.37
  Bottom 0.305: J1.19 11.44,19.8 10.11,18.47 v10.11,12.37
N$9  (via drill 0.3)
  Top 0.305: C46.1 9.32,12.05 v9.32,12.32
  Bottom 0.305: v9.32,12.32 9.32,18.75 11.18,20.6 J1.20
N$10  (via drill 0.3)
  Top 0.305: C47.1 v8,12.34
  Bottom 0.305: J1.22 10.77,22.2 8,19.43 v8,12.34
N$11
  Top 0.305: D1.C D4.A C50.1
N$21  (via drill 0.3)
  Top 0.406: TF.P1 44.72,4 v44.7,4.01 | v48.49,4.01 48.63,4.01 R8.1
  Bottom 0.406: v44.7,4.01 v48.49,4.01
N$22  (via drill 0.3)
  Top 0.305: C44.1 11.05,11.9 v11.05,12.37
  Bottom 0.305: J1.18 11.56,19 11.05,18.49 v11.05,12.37
N$23
  Top 0.406: R3.1 18.22,17.32 IC2.5
N$28  (via drill 0.3)
  Top 0.203: v37.37,5.41 v37.36,5.41
  Top 0.406: TF.P8 v37.37,5.41 | R10.1 v48.46,5.41
  Bottom 0.406: v37.36,5.41 v48.46,5.41
N$29  (1 unrouted)
  Top 0.203: R35.1 52.01,5.29
  Top 0.406: 52.01,5.29 D5.1
N$30
  Top 0.406: IC2.1 17.89,21.28 R5.2
N$32
  Top 0.406: D3.- 19.58,21.55 R5.1
N$33  (1 unrouted)
  Top 0.203: U3.3 46.22,20.11 C4.2 46.22,21.2 L2.2 | U3.2 U3.3 | U3.3 | 44.55,17.96 44.63,17.96 46.43,19.76 46.43,20.83 46.91,21.31 46.69,21.54 46.3,21.54 46,21.23 46,19.86 44.3,18.16 44.55,17.91 44.55,18.16 46.28,19.89 46.28,20.9 46.61,21.23 46.2,21.23 46.1,21.13 46.1,20.93 | 46.1,20.65 46.1,20.93 | 46.1,20.93 46.35,21.18
N$34
  Top 0.254: USB1.B5 24.31,19.8 R31.1
N$35
  Top 0.203: U3.34 37.12,14.41 R16.2
N$37
  Top 0.203: U3.54 45.09,15.37 R34.2
N$38
  Top 0.203: U3.33 36.55,14.4 36.55,12.24 R18.2
N$40
  Top 0.203: U3.31 35.32,14.3 R23.2
N$41
  Top 0.203: U3.30 34.55,14.11 R25.2
N$63
  Top 0.203: U3.49 45.78,11.84 R12.2
N$65
  Top 0.203: U3.53 46.46,13.42 C13.2 48.13,12.84 X1.3
N$66
  Top 0.203: R34.1 47.77,15.52 50.28,15.52 C19.1 51.24,15.04 X1.1
N$71  (1 unrouted)
  Top 0.61: Q12.3 14.73,5.69 14.73,7.95 14.68,7.9 D6.A 15.29,7.9 | 15.29,7.9 16.57,7.9 L3.P$2 | C50.2 15.2,7.99 15.29,7.9
  Top 0.813: 14.55,5.59 14.66,5.49 17.3,5.49 17.3,9.45 15.29,9.45 15.29,6.07 16.03,6.07 16.03,9.14
N$76
  Top 0.254: 6.76,14.19 C7.2
  Top 0.406: U5.4 6.76,14.19
PREVGH  (via drill 0.3)
  Top 0.305: D6.C 12.54,7.98 C52.1 v10.13,8.64
  Bottom 0.305: J1.21 10.99,21.4 8.66,19.07 8.66,11.25 10.13,9.78 v10.13,8.64
PREVGL  (via drill 0.3)
  Top 0.305: D1.A C49.1 8.43,9.56 v8.43,10.03
  Bottom 0.305: J1.23 10.63,23 7.34,19.71 7.34,11.12 v8.43,10.03
RESE  (via drill 0.3)
  Top 0.305: Q12.2 12.59,4.65 v11.84,4.65 R33.1
  Bottom 0.305: J1.3 16.65,7 17.22,6.43 17.22,4.88 16.82,4.47 12.01,4.47 v11.84,4.65
RESET  (1 unrouted)
  Top 0.203: R15.1 47.51,23.47 | 47.51,23.47 C10.2 | 47.51,23.47 47.45,23.53 RST.2 45.52,22.66 45.52,19.98 U3.4 | 47.52,23.04 47.3,23.04 47.3,23.29 47.07,23.52 47.3,23.75 47.3,24 47.37,23.93 47.37,23.14
SPICLK
  Top 0.203: R18.1 33.81,9.5 33.81,6.93 33.43,6.56 U4.6
SPICS0  (via drill 0.3)
  Top 0.203: U3.32 36.09,14.51 36.09,12.85 33.33,10.08 33.33,7.37 v33.17,7.21 | U4.1 23.16,9.07 23.7,9.07 25.48,7.29 v25.48,6.53
  Bottom 0.203: v25.48,6.53 32.74,6.53 33.17,6.96 v33.17,7.21
SPID
  Top 0.203: R28.1 36.6,9.9 36.13,9.9 35.75,9.9 34.72,8.87 34.72,6.25 33.76,5.28 U4.5
SPIHD
  Top 0.203: R25.1 32.36,11.66 32.36,8.33 31.86,7.83 U4.7
SPIQ  (via drill 0.3)
  Top 0.203: 36.13,10.63 R16.1 35.73,10.63 34.27,9.17 34.27,6.6 33.6,5.94 v32.99,5.94 | U4.2 24.17,7.83 24.87,7.14 v24.87,5.94
  Bottom 0.203: v32.99,5.94 v24.87,5.94
SPIWP  (via drill 0.3)
  Top 0.203: R23.1 32.82,10.57 32.82,7.75 32.44,7.37 v32.44,7.19 | U4.3 24.14,6.56 v24.16,6.58
  Bottom 0.203: v24.16,6.58 24.66,7.09 32.33,7.09 v32.44,7.19
U0RXD
  Top 0.203: U3.50 46.51,11.68 RX.T
U0TXD
  Top 0.203: R12.1 46.85,10.67 TX.T
USB_D+
  Top 0.254: R21.2 25.31,19.76 USB1.B6 25.31,22.8 25.55,23.04 26.09,23.04 26.31,22.81 USB1.A6
USB_D-
  Top 0.203: 26.09,20.65 26.14,20.65 26.36,20.42 26.36,20.47 26.54,20.65
  Top 0.254: USB1.B7 26.81,20.85 26.61,20.65 26.54,20.65 26.24,20.65 | USB1.A7 25.81,20.85 26.01,20.65 26.09,20.65 26.24,20.65 | R20.2 26.34,20.55 26.24,20.65
VBAT
  Top 0.61: 15.99,21.77 IC2.3 15.1,19.36 Q1.3 | C20.2 16.07,21.84 15.99,21.77 | 15.99,21.77 15.99,24.22 17.58,25.81 BAT.1
VCOM  (via drill 0.3)
  Top 0.305: C48.1 6.66,11.93 v6.66,12.34
  Bottom 0.305: J1.24 10.41,23.8 6.66,20.04 v6.66,12.34
VDD_SPI
  Top 0.203: U3.29 34.58,14.7 C12.2 33.98,14.58 33.98,14.55
  Top 0.61: U4.8 31.23,10.93 C37.2 31.25,11.82 33.98,14.55 33.98,14.58
VRTC
  Top 0.61: U5.3 C16.2 C38.2 8.69,19.77 | 8.69,19.77 9.18,19.77 C6.2 10.08,19.79 D2.- 11.46,18.41 Q1.2 | U5.1 8.66,19.75 8.69,19.77

### Text on the board
tPlace: - | +
bPlace: MaTouch ESP32-S3 2.13" | Quad-Color Eink V1.1 | www.makerfabs.com